# Altium schematic sheet a1200_keyboard_adapter.SchDoc
size A4
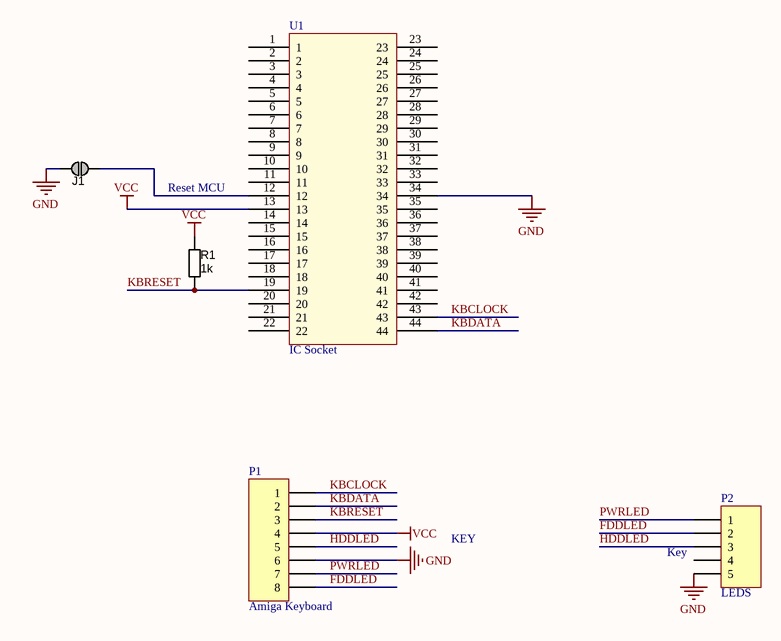
[diagram p0: a1200_keyboard_adapter.SchDoc]

## Parts
J1  Jumper  [JUMP1]  (value not drawn)  (no BOM)
P1  Amiga Keyboard  [HDR1X8]
P2  LEDS  [HDR1X5]
R1  value 1k  [RESC2012N_ZERO]  (hidden comment: 0805)
U1  IC Socket  [PLCC44_THD]

## Nets
GND: J1.2 P1.6 P2.5 U1.34
VCC: P1.4 R1.2 U1.13
FDDLED: P1.8 P2.2
HDDLED: P1.5 P2.3
KBCLOCK: P1.1 U1.43
KBDATA: P1.2 U1.44
KBRESET: P1.3 R1.1 U1.19
PWRLED: P1.7 P2.1
NetJ1_1: J1.1 U1.12

Not connected (* = marked no-connect by the designer): P2 4; U1 1 2 3 4 5 6 7 8 9 10 11 14 15 16 17 18 20 21 22 23 24 25 26 27 28 29 30 31 32 33 35 36 37 38 39 40 41 42

## Notes on the sheet
- Reset MCU
- KEY
- (near P2) Key

## Library data of the parts
J1 = JUMP1: SMD jumper
P1 = Header 8: Header, 8-Pin; LatestRevisionDate: 17-Jul-2002; LatestRevisionNote: Re-released for DXP Platform.; Publisher: Altium Limited
P2 = Header 5: Header, 5-Pin; LatestRevisionDate: 17-Jul-2002; LatestRevisionNote: Re-released for DXP Platform.; Publisher: Altium Limited
R1 = RES_0R_0805: Resistor SMD chip 0.0 Ohm 0.125W 0805; Manufacturer 1: Samsung Electro-Mechanics America, Inc; Manufacturer Part Number 1: RC2012J000CS; Ratings: 1/8W; SCDType: spec; Tolerance: N/A; Package / Case: 0805 (2012 metric); Supplier 1: Digi-Key; Supplier Part Number 1: 1276-5466-6-ND; RoHS 1: RoHS Compliant; ComponentLink1URL: http://www.samsungsem.com/servlet/FileDownload?filename=productcatalog/pdf/Chip_Resistor.pdf; ComponentLink1Description: http://www.samsungsem.com/servlet/FileDownload?filename=productcatalog/pdf/Chip_Resistor.pdf; Supplier 2: Digi-Key; Supplier Part Number 2: RMCF0805ZT0R00DKR-ND; Manufacturer 2: Stackpole Electronics Inc; Manufacturer Part Number 2: RMCF0805ZT0R00; RoHS 2: RoHS Compliant; ComponentLink2URL: http://www.seielect.com/Catalog/SEI-RMCF_RMCP.pdf; ComponentLink2Description: http://www.seielect.com/Catalog/SEI-RMCF_RMCP.pdf; Supplier 3: Digi-Key; Supplier Part Number 3: 311-0.0ARDKR-ND; Manufacturer 3: Yageo; Manufacturer Part Number 3: RC0805JR-070RL; RoHS 3: RoHS Compliant; ComponentLink3URL: http://media.digikey.com/pdf/Data%20Sheets/Yageo%20PDFs/RC0805%20Pb%20Free.pdf; ComponentLink3Description: http://media.digikey.com/pdf/Data%20Sheets/Yageo%20PDFs/RC0805%20Pb%20Free.pdf; Supplier 4: Digi-Key; Supplier Part Number 4: P0.0ADKR-ND; Manufacturer 4: Panasonic Electronic Components; Manufacturer Part Number 4: ERJ-6GEY0R00V; RoHS 4: RoHS Compliant; ComponentLink4URL: http://industrial.panasonic.com/www-cgi/jvcr13pz.cgi?E+PZ+3+AOA0001+ERJ6GEY0R00V+7+WW; ComponentLink4Description: http://industrial.panasonic.com/www-cgi/jvcr13pz.cgi?E+PZ+3+AOA0001+ERJ6GEY0R00V+7+WW; Supplier 5: Digi-Key; Supplier Part Number 5: RHM0.0CPDKR-ND; Manufacturer 5: Rohm Semiconductor; Manufacturer Part Number 5: MCR10ERTJ000; RoHS 5: RoHS Compliant; ComponentLink5URL: http://rohmfs.rohm.com/en/products/databook/datasheet/passive/resistor/chip_resistor/mcr_g.pdf; ComponentLink5Description: http://rohmfs.rohm.com/en/products/databook/datasheet/passive/resistor/chip_resistor/mcr_g.pdf
U1 = IC_SOCKET_44: 44-pin IC socket